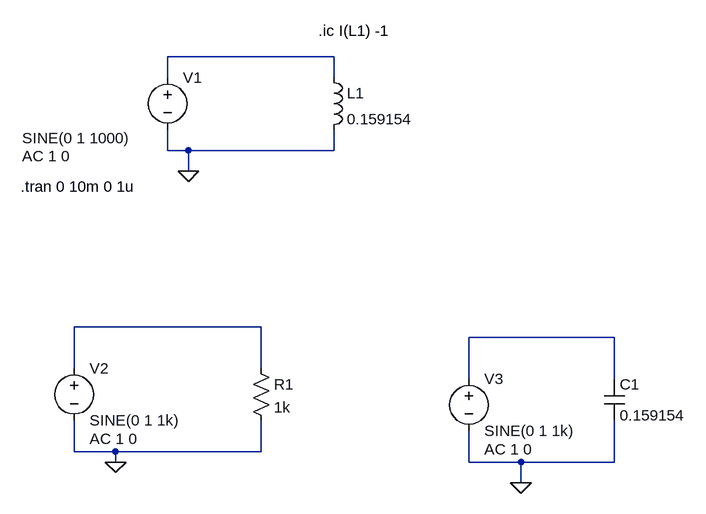
[diagram p0: schematic LandRandC.asc]
LandRandC.asc, the LTspice schematic file:
Version 4
SHEET 1 880 772
WIRE 304 96 48 96
WIRE 48 128 48 96
WIRE 304 128 304 96
WIRE 48 240 48 208
WIRE 80 240 48 240
WIRE 304 240 304 208
WIRE 304 240 80 240
WIRE 80 272 80 240
WIRE 192 512 -96 512
WIRE 736 528 512 528
WIRE -96 576 -96 512
WIRE 192 576 192 512
WIRE 512 592 512 528
WIRE 736 592 736 528
WIRE -96 704 -96 656
WIRE -32 704 -96 704
WIRE 192 704 192 656
WIRE 192 704 -32 704
WIRE -32 720 -32 704
WIRE 512 720 512 672
WIRE 592 720 512 720
WIRE 736 720 736 656
WIRE 736 720 592 720
WIRE 592 752 592 720
FLAG 80 272 0
FLAG -32 720 0
FLAG 592 752 0
SYMBOL voltage 48 112 R0
WINDOW 3 -224 109 Left 2
WINDOW 123 -224 137 Left 2
WINDOW 39 0 0 Left 0
SYMATTR InstName V1
SYMATTR Value SINE(0 1 1000)
SYMATTR Value2 AC 1 0
SYMBOL ind 288 112 R0
SYMATTR InstName L1
SYMATTR Value 0.159154
SYMBOL voltage -96 560 R0
WINDOW 123 24 124 Left 2
WINDOW 39 0 0 Left 0
SYMATTR InstName V2
SYMATTR Value SINE(0 1 1k)
SYMATTR Value2 AC 1 0
SYMBOL res 176 560 R0
SYMATTR InstName R1
SYMATTR Value 1k
SYMBOL voltage 512 576 R0
WINDOW 123 24 124 Left 2
WINDOW 39 0 0 Left 0
SYMATTR InstName V3
SYMATTR Value SINE(0 1 1k)
SYMATTR Value2 AC 1 0
SYMBOL cap 720 592 R0
SYMATTR InstName C1
SYMATTR Value 0.159154
TEXT -178 296 Left 2 !.tran 0 10m 0 1u
TEXT 280 56 Left 2 !.ic I(L1) -1

The netlist it stands for:
* LandRandC.asc
V1 N001 0 SINE(0 1 1000) AC 1 0
L1 N001 0 0.159154
V2 N002 0 SINE(0 1 1k) AC 1 0
R1 N002 0 1k
V3 N003 0 SINE(0 1 1k) AC 1 0
C1 N003 0 0.159154
.tran 0 10m 0 1u
.ic I(L1) -1
.backanno
.end